# Altium project Impedance spectrometer.PrjPcb
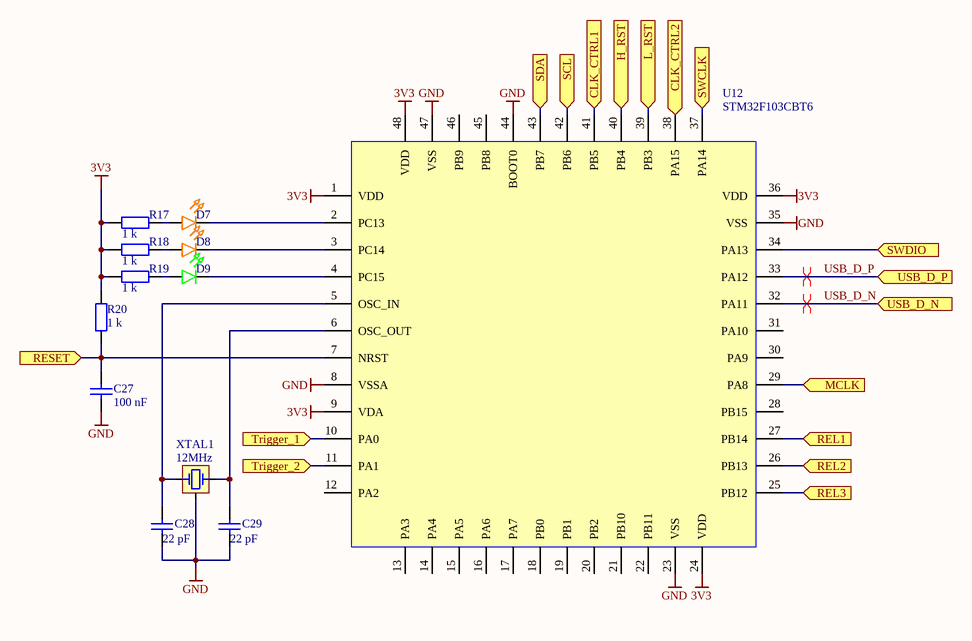
[diagram p0: Back-end.SchDoc]
4 sheets, 98 parts. Net scope: flat (ports and power ports of the same name join across sheets).
Board file: Impedance spectrometer.PcbDoc
Sheets:
  Back-end.SchDoc
  Back-end_2.SchDoc
  Front-end.SchDoc
  Power.SchDoc

## Sheet Back-end.SchDoc
size A4

### Parts
C27  100 nF  [C1206]
C28  22 pF  [C1206]
C29  22 pF  [C1206]
D7  LED Orange  [LED Diod red]  (value not drawn)
D8  LED Orange  [LED Diod red]  (value not drawn)
D9  *  [LED Diod grean]  (value not drawn)
R17  1 k  [R1206]
R18  1 k  [R1206]
R19  1 k  [R1206]
R20  1 k  [R1206]
U12  STM32F103CBT6  [LQFP48_L]
XTAL1  Value1: 12MHz  [XTAL 2.5MM X3.2MM]  (hidden comment: 7M-12.000MAAJ-T)

### Ports
CLK_CTRL1, CLK_CTRL2, H_RST, L_RST, MCLK, REL1, REL2, REL3, RESET, SCL, SDA, SWCLK, SWDIO, Trigger_1, Trigger_2, USB_D_N, USB_D_P

### Nets
3V3: R17.2 R18.2 R19.2 R20.2 U12.1(VDD) U12.9(VDA) U12.24(VDD) U12.36(VDD) U12.48(VDD)
GND: C27.1 C28.2 C29.2 U12.8(VSSA) U12.23(VSS) U12.35(VSS) U12.44(BOOT0) U12.47(VSS) XTAL1.2
USB_D_N: U12.32(PA11) ; port USB_D_N
USB_D_P: U12.33(PA12) ; port USB_D_P
NetC27_2: C27.2 R20.1 U12.7(NRST) ; port RESET
NetC28_1: C28.1 U12.5(OSC_IN) XTAL1.1(OSC1)
NetC29_1: C29.1 U12.6(OSC_OUT) XTAL1.3(OSC2)
NetD3_1: U12.29(PA8) ; port MCLK
NetD5_1: U12.43(PB7) ; port SDA
NetD5_2: U12.42(PB6) ; port SCL
NetD7_1: D7.1 R17.1
NetD7_2: D7.2 U12.2(PC13)
NetD8_1: D8.1 R18.1
NetD8_2: D8.2 U12.3(PC14)
NetD9_1: D9.1 R19.1
NetD9_2: D9.2 U12.4(PC15)
NetD10_1: U12.10(PA0) ; port Trigger_1
NetD10_2: U12.11(PA1) ; port Trigger_2
NetP3_2: U12.37(PA14) ; port SWCLK
NetP3_4: U12.34(PA13) ; port SWDIO
NetQ1_2: U12.40(PB4) ; port H_RST
NetQ2_2: U12.39(PB3) ; port L_RST
NetU10_1: U12.27(PB14) ; port REL1
NetU10_2: U12.26(PB13) ; port REL2
NetU10_3: U12.25(PB12) ; port REL3
NetU11_5: U12.38(PA15) ; port CLK_CTRL2
NetU11_6: U12.41(PB5) ; port CLK_CTRL1

Not connected (* = marked no-connect by the designer): U12 12(PA2) 13(PA3) 14(PA4) 15(PA5) 16(PA6) 17(PA7) 18(PB0) 19(PB1) 20(PB2) 21(PB10) 22(PB11) 28(PB15) 30(PA9) 31(PA10) 45(PB8) 46(PB9)

### Layout directives
differential pair: USB_D_N, USB_D_P

### Library data of the parts
C27 = Cap Semi: Capacitor (Semiconductor SIM Model); Value: 100n; Published: 8-Jun-2000; LatestRevisionDate: 29-May-2009; LatestRevisionNote: IPC-7351 Footprint Added.; PackageReference: C1206; Publisher: Altium Limited; PackageDescription: Chip Capacitor
C28 C29 = Cap Semi: Capacitor (Semiconductor SIM Model); Published: 8-Jun-2000; LatestRevisionDate: 29-May-2009; LatestRevisionNote: IPC-7351 Footprint Added.; PackageReference: C1206; Publisher: Altium Limited; PackageDescription: r0805; Value: 22 pF
D7 D8 = LED SMD Diod Orange
D9 = LED SMD Diod Green: Assembly: SMD; ComponentLink1URL: *; ComponentLink2URL: *; ComponentLink1Description: Datasheet; ComponentLink2Description: *; Tolerance1: *; Value1: *; Manufacture: *; Shop1: *; Shop1ID: *; ComponentType: Diod LED; DafaultFootprint: *; Replacement: *; Value2: *; Parameter1: *; Parameter2: *; ComponentSymbol: *; Tolerance2: *
R17-R20 = Res2: Resistor; Value: 1K; Published: 8-Jun-2000; LatestRevisionDate: 17-Jul-2002; LatestRevisionNote: Re-released for DXP Platform.; PackageReference: AXIAL-0.4; Publisher: Altium Limited; PackageDescription: Axial Device, Thru-Hole; 2 Leads; 0.4 in Pin Spacing
U12 = STM32F070CxTxx
XTAL1 = XTAL 12MHz: TXC  7M-12.000MAAJ-T  CRYSTAL, 12MHZ, 18PF, 3.2 X 2.5MM; Tolerance1: 18ppm; Value1: Farnell; Shop1ID: 2413996; DafaultFootprint: SMD XTAL 3.2mm x 2.5mm; Assembly: SMD; Parameter1: Freq; ComponentLink1URL: http://www.farnell.com/datasheets/1796637.pdf?_ga=1.82791254.1104608453.1473079731; ComponentLink2URL: *; ComponentLink1Description: Datasheet; ComponentLink2Description: *; Manufacture: TXC; ComponentType: Oscillator Quartz; Replacement: *; ComponentSymbol: 7M-12.000MAAJ-T

## Sheet Back-end_2.SchDoc
size A4
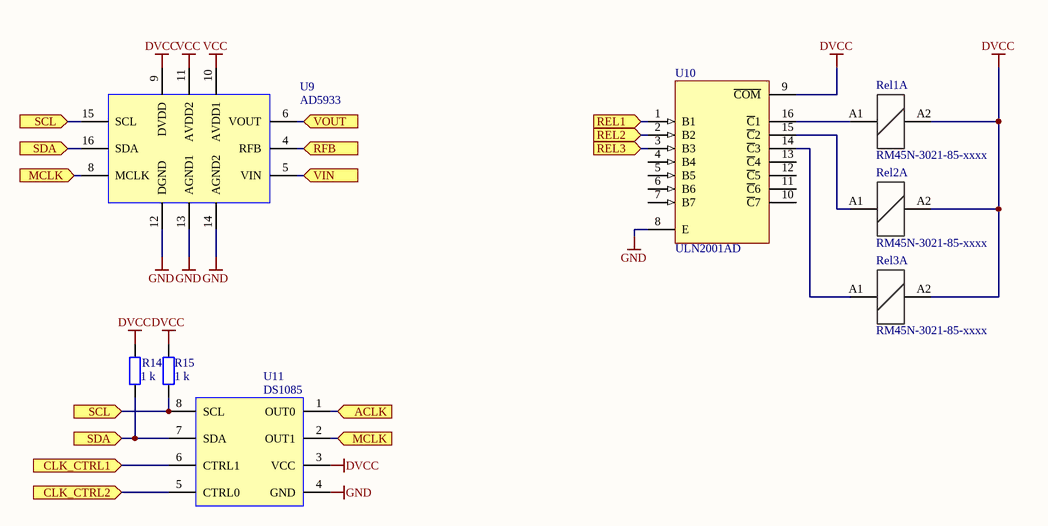
[diagram p1: Back-end_2.SchDoc]

### Parts
R14  1 k  [R1206]
R15  1 k  [R1206]
Rel1  RM45N-3021-85-xxxx  (part A of 2)
Rel2  RM45N-3021-85-xxxx  (part A of 2)
Rel3  RM45N-3021-85-xxxx  (part A of 2)
U9  AD5933
U10  ULN2001AD  [D016_N]
U11  DS1085

### Ports
ACLK, CLK_CTRL1, CLK_CTRL2, MCLK, REL1, REL2, REL3, RFB, SCL, SDA, VIN, VOUT

### Nets
DVCC: R14.2 R15.2 Rel1.A2(COIL) Rel2.A2(COIL) Rel3.A2(COIL) U9.9(DVDD) U10.9(~{COM}) U11.3(VCC)
GND: U9.12(DGND) U9.13(AGND1) U9.14(AGND2) U10.8(E) U11.4(GND)
VCC: U9.10(AVDD1) U9.11(AVDD2)
NetD3_1: U9.8(MCLK) U11.2(OUT1) ; port MCLK
NetD4_1: U11.1(OUT0) ; port ACLK
NetD5_1: R14.1 U9.16(SDA) U11.7(SDA) ; port SDA
NetD5_2: R15.1 U9.15(SCL) U11.8(SCL) ; port SCL
NetR1_1: U9.5(VIN) ; port VIN
NetR1_2: U9.4(RFB) ; port RFB
NetR11_2: U9.6(VOUT) ; port VOUT
NetRel1_A1: Rel1.A1(COIL) U10.16(~{C}1)
NetRel2_A1: Rel2.A1(COIL) U10.15(~{C}2)
NetRel3_A1: Rel3.A1(COIL) U10.14(~{C}3)
NetU10_1: U10.1(B1) ; port REL1
NetU10_2: U10.2(B2) ; port REL2
NetU10_3: U10.3(B3) ; port REL3
NetU11_5: U11.5(CTRL0) ; port CLK_CTRL2
NetU11_6: U11.6(CTRL1) ; port CLK_CTRL1

Not connected (* = marked no-connect by the designer): U10 4(B4) 5(B5) 6(B6) 7(B7) 10(~{C}7) 11(~{C}6) 12(~{C}5) 13(~{C}4)

### Library data of the parts
R14 R15 = Res2: Resistor; Value: 1K; Published: 8-Jun-2000; LatestRevisionDate: 17-Jul-2002; LatestRevisionNote: Re-released for DXP Platform.; PackageReference: AXIAL-0.4; Publisher: Altium Limited; PackageDescription: Axial Device, Thru-Hole; 2 Leads; 0.4 in Pin Spacing
U10 = ULN2001AD: Darlington Transistor Array; ComponentAvailability: Obsolete; Published: 15-May-2002; LatestRevisionDate: 13-Apr-2006; LatestRevisionNote: IPC-7351 Footprint Added.; DatasheetVersion: Sep-1986; PackageVersion: Jan-1998; PackageReference: D016; Publisher: Altium Limited; PackageDescription: 16-Pin Small Outline Integrated Circuit 1.27 mm Pitch; Code_IPC: SOIC127P600-16; ComponentLink1Description: Manufacturer Link; ComponentLink1URL: http://www.ti.com/; ComponentLink2Description: Datasheet; ComponentLink2URL: http://www-s.ti.com/sc/ds/uln2002a.pdf

## Sheet Front-end.SchDoc
size A4
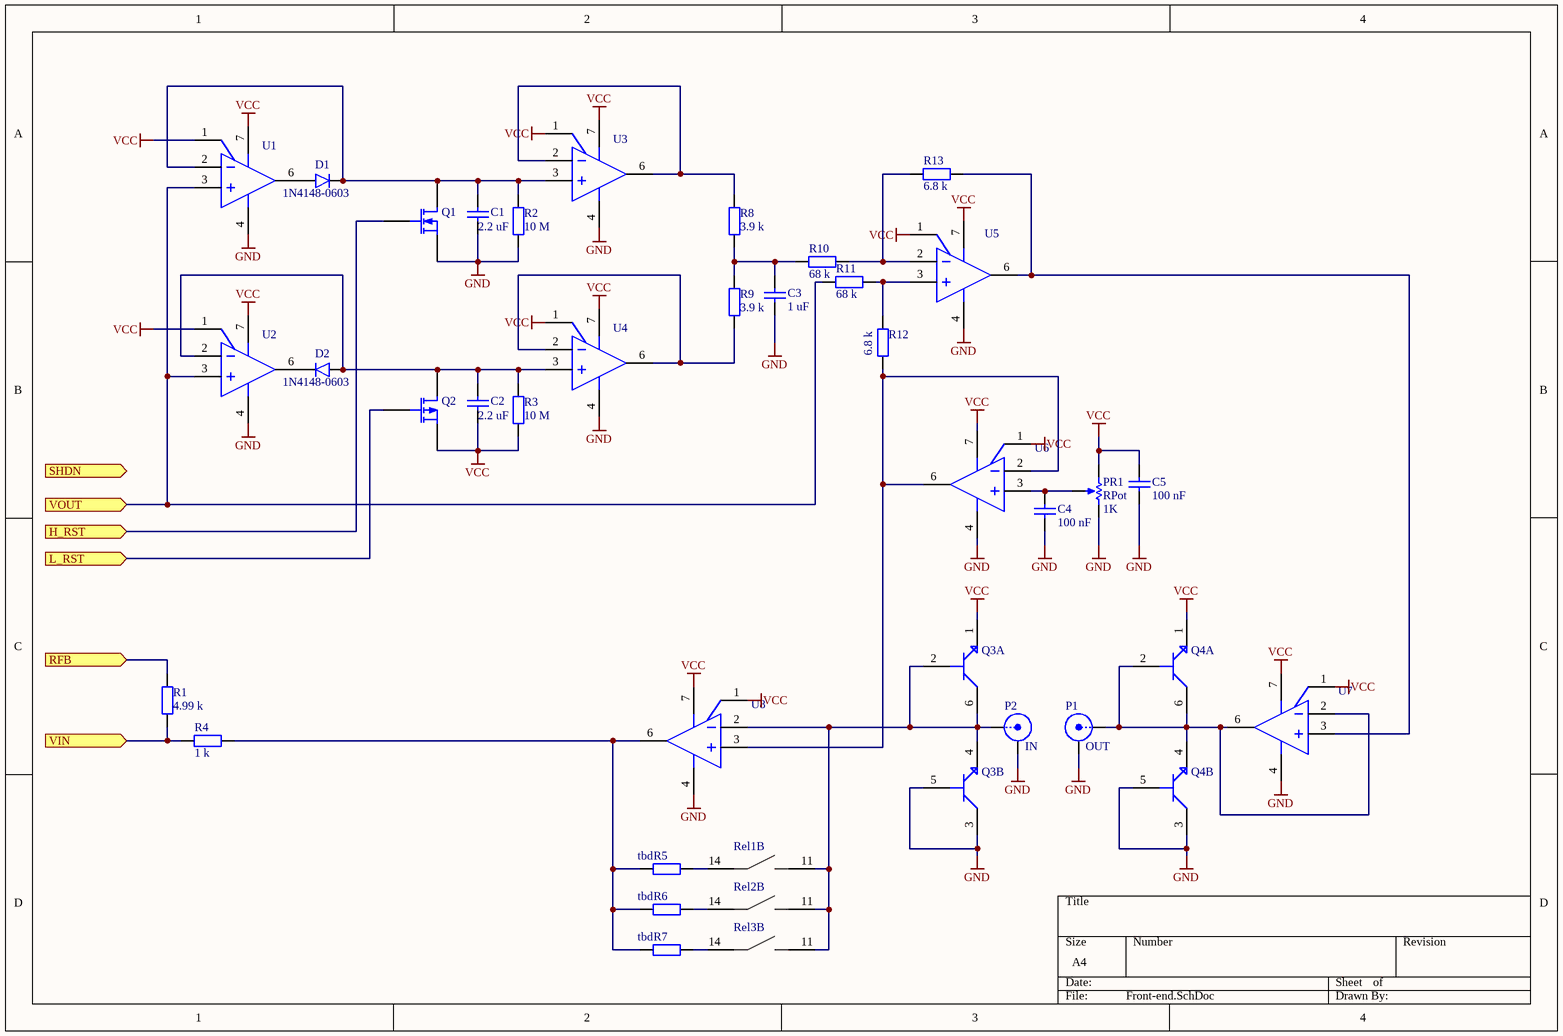
[diagram p2: Front-end.SchDoc]

### Parts
C1  2.2 uF  [C1206]
C2  2.2 uF  [C1206]
C3  1 uF  [C1206]
C4  100 nF  [C1206]
C5  100 nF  [C1206]
D1  1N4148-0603  [C1206]
D2  1N4148-0603  [C1206]
P1  OUT  [BNC_RA]
P2  IN  [BNC_RA]
PR1  RPot  value 1K  [TrimmPot]
Q1  MOSFET-N  [E3]  (value not drawn)
Q2  MOSFET-P  [E3]  (value not drawn)
Q3  MBT3904DW1T1G  (value not drawn)  (parts A,B of 2)
Q4  MBT3904DW1T1G  (value not drawn)  (parts A,B of 2)
R1  4.99 k  [R1206]
R2  10 M  [R1206]
R3  10 M  [R1206]
R4  1 k  [R1206]
R5  tbd  [R1206]
R6  tbd  [R1206]
R7  tbd  [R1206]
R8  3.9 k  [R1206]
R9  3.9 k  [R1206]
R10  68 k  [R1206]
R11  68 k  [R1206]
R12  6.8 k  [R1206]
R13  6.8 k  [R1206]
Rel1  RM45N-3021-85-xxxx  [RM45N-3021-85-xxxx]  (value not drawn)  (part B of 2)
Rel2  RM45N-3021-85-xxxx  [RM45N-3021-85-xxxx]  (value not drawn)  (part B of 2)
Rel3  RM45N-3021-85-xxxx  [RM45N-3021-85-xxxx]  (value not drawn)  (part B of 2)
U1  MAX4238  [NSO8_L]  (value not drawn)
U2  MAX4238  [NSO8_L]  (value not drawn)
U3  MAX4238  [NSO8_L]  (value not drawn)
U4  MAX4238  [NSO8_L]  (value not drawn)
U5  MAX4238  [NSO8_L]  (value not drawn)
U6  MAX4238  [NSO8_L]  (value not drawn)
U7  MAX4238  [NSO8_L]  (value not drawn)
U8  MAX4238  [NSO8_L]  (value not drawn)

### Ports
H_RST, L_RST, RFB, SHDN, VIN, VOUT

### Nets
GND: C1.1 C3.1 C4.1 C5.1 P1.2(Y) P2.2(Y) PR1.2(BOT) Q1.3(S) Q3.3 Q3.5 Q4.3 Q4.5 R2.1 U1.4 U2.4 U3.4 U4.4 U5.4 U6.4 U7.4 U8.4
VCC: C2.1 C5.2 PR1.1(TOP) Q2.3(S) Q3.1 Q4.1 R3.1 U1.1(SHDN) U1.7 U2.1(SHDN) U2.7 U3.1(SHDN) U3.7 U4.1(SHDN) U4.7 U5.1(SHDN) U5.7 U6.1(SHDN) U6.7 U7.1(SHDN) U7.7 U8.1(SHDN) U8.7
NetC1_2: C1.2 D1.1 Q1.1(D) R2.2 U1.2(-) U3.3(+)
NetC2_2: C2.2 D2.2 Q2.1(D) R3.2 U2.2(-) U4.3(+)
NetC3_2: C3.2 R8.1 R9.2 R10.2
NetC4_2: C4.2 PR1.3(TAP) U6.3(+)
NetD1_2: D1.2 U1.6
NetD2_1: D2.1 U2.6
NetP1_1: P1.1(X) Q4.2 Q4.4 Q4.6 U7.2(-) U7.6
NetP2_1: P2.1(X) Q3.2 Q3.4 Q3.6 Rel1.11(SW) Rel2.11(SW) Rel3.11(SW) U8.2(-)
NetQ1_2: Q1.2(G) ; port H_RST
NetQ2_2: Q2.2(G) ; port L_RST
NetR1_1: R1.1 R4.2 ; port VIN
NetR1_2: R1.2 ; port RFB
NetR4_1: R4.1 R5.2 R6.2 R7.2 U8.6
NetR5_1: R5.1 Rel1.14(SW)
NetR6_1: R6.1 Rel2.14(SW)
NetR7_1: R7.1 Rel3.14(SW)
NetR8_2: R8.2 U3.2(-) U3.6
NetR9_1: R9.1 U4.2(-) U4.6
NetR10_1: R10.1 R13.2 U5.2(-)
NetR11_1: R11.1 R12.1 U5.3(+)
NetR11_2: R11.2 U1.3(+) U2.3(+) ; port VOUT
NetR12_2: R12.2 U6.2(-) U6.6 U8.3(+)
NetR13_1: R13.1 U5.6 U7.3(+)

### Library data of the parts
C1 C2 = Cap Semi: Capacitor (Semiconductor SIM Model); Value: 2u2; Published: 8-Jun-2000; LatestRevisionDate: 29-May-2009; LatestRevisionNote: IPC-7351 Footprint Added.; PackageReference: C1206; Publisher: Altium Limited; PackageDescription: Chip Capacitor
C3 = Cap Semi: Capacitor (Semiconductor SIM Model); Value: 1u; Published: 8-Jun-2000; LatestRevisionDate: 29-May-2009; LatestRevisionNote: IPC-7351 Footprint Added.; PackageReference: C1206; Publisher: Altium Limited; PackageDescription: Chip Capacitor
C4 C5 = Cap Semi: as C27 on sheet Back-end; Published: 8-Jun-2000; LatestRevisionDate: 29-May-2009; LatestRevisionNote: IPC-7351 Footprint Added.; PackageReference: C1206; Publisher: Altium Limited; PackageDescription: Chip Capacitor
D1 D2 = 1N4148: Dioda: przełączająca; SMD; 100V; 150mA; 4ns; 0603; Manufacture: DC COMPONENTS; Shop1: TME; DafaultFootprint: 0603; Value1: 75V; Parameter1: Vr; Parameter2: If; ComponentLink1URL: http://www.tme.eu/pl/Document/56f18f971963fb7c3e40973a6fd3d82c/CD4148W_WT.pdf; ComponentLink2URL: *; ComponentLink1Description: Datasheet; ComponentLink2Description: *; Tolerance1: *; Shop1ID: *; ComponentType: Diod Rectifier; Assembly: SMD; Replacement: *; ComponentSymbol: 1N4148-0603; Value2: 150mA
P1 P2 = BNC: BNC Elbow Connector; LatestRevisionDate: 17-Jul-2002; LatestRevisionNote: Re-released for DXP Platform.; Publisher: Altium Limited
PR1 = RPot: Potentiometer; Sim Note: Enter the Resistance value and the set point into parameter fields.; Set Position: 0.5; Published: 8-Jun-2000; LatestRevisionDate: 17-Jul-2002; LatestRevisionNote: Re-released for DXP Platform.; PackageReference: VR5; Publisher: Altium Limited; PackageDescription: Variable Resistor, Thru-Hole; 3 Leads
Q1 = MOSFET-N: N-Channel MOSFET; Published: 8-Jun-2000; LatestRevisionDate: 17-Jul-2002; LatestRevisionNote: Re-released for DXP Platform.; PackageVersion: 1995/1996; PackageReference: E3; Publisher: Altium Limited; PackageDescription: TO, Flat Index; 3 In-Line, Axial Leads; Body Dia. 4.6mm; Lead Dia. 0.5 mm (max)
Q2 = MOSFET-P: P-Channel MOSFET; Published: 8-Jun-2000; LatestRevisionDate: 17-Jul-2002; LatestRevisionNote: Re-released for DXP Platform.; PackageVersion: 1995/1996; PackageReference: E3; Publisher: Altium Limited; PackageDescription: TO, Flat Index; 3 In-Line, Axial Leads; Body Dia. 4.6mm; Lead Dia. 0.5 mm (max)
R1 = Res2: Resistor; Value: 4k99; Published: 8-Jun-2000; LatestRevisionDate: 17-Jul-2002; LatestRevisionNote: Re-released for DXP Platform.; PackageReference: AXIAL-0.4; Publisher: Altium Limited; PackageDescription: Axial Device, Thru-Hole; 2 Leads; 0.4 in Pin Spacing
R2 R3 = Res2: Resistor; Value: 10M; Published: 8-Jun-2000; LatestRevisionDate: 17-Jul-2002; LatestRevisionNote: Re-released for DXP Platform.; PackageReference: AXIAL-0.4; Publisher: Altium Limited; PackageDescription: Axial Device, Thru-Hole; 2 Leads; 0.4 in Pin Spacing
R4 = Res2: Resistor; Value: 1k; Published: 8-Jun-2000; LatestRevisionDate: 17-Jul-2002; LatestRevisionNote: Re-released for DXP Platform.; PackageReference: AXIAL-0.4; Publisher: Altium Limited; PackageDescription: Axial Device, Thru-Hole; 2 Leads; 0.4 in Pin Spacing
R5-R7 = Res2: Resistor; Value: 1K; Published: 8-Jun-2000; LatestRevisionDate: 17-Jul-2002; LatestRevisionNote: Re-released for DXP Platform.; PackageReference: AXIAL-0.4; Publisher: Altium Limited; PackageDescription: Axial Device, Thru-Hole; 2 Leads; 0.4 in Pin Spacing
R8 R9 = Res2: Resistor; Value: 3k9; Published: 8-Jun-2000; LatestRevisionDate: 17-Jul-2002; LatestRevisionNote: Re-released for DXP Platform.; PackageReference: AXIAL-0.4; Publisher: Altium Limited; PackageDescription: Axial Device, Thru-Hole; 2 Leads; 0.4 in Pin Spacing
R10 R11 = Res2: Resistor; Value: 68k; Published: 8-Jun-2000; LatestRevisionDate: 17-Jul-2002; LatestRevisionNote: Re-released for DXP Platform.; PackageReference: AXIAL-0.4; Publisher: Altium Limited; PackageDescription: Axial Device, Thru-Hole; 2 Leads; 0.4 in Pin Spacing
R12 R13 = Res2: Resistor; Value: 6k8; Published: 8-Jun-2000; LatestRevisionDate: 17-Jul-2002; LatestRevisionNote: Re-released for DXP Platform.; PackageReference: AXIAL-0.4; Publisher: Altium Limited; PackageDescription: Axial Device, Thru-Hole; 2 Leads; 0.4 in Pin Spacing
U1-U8 = MAX4298/4299

## Sheet Power.SchDoc
size A4
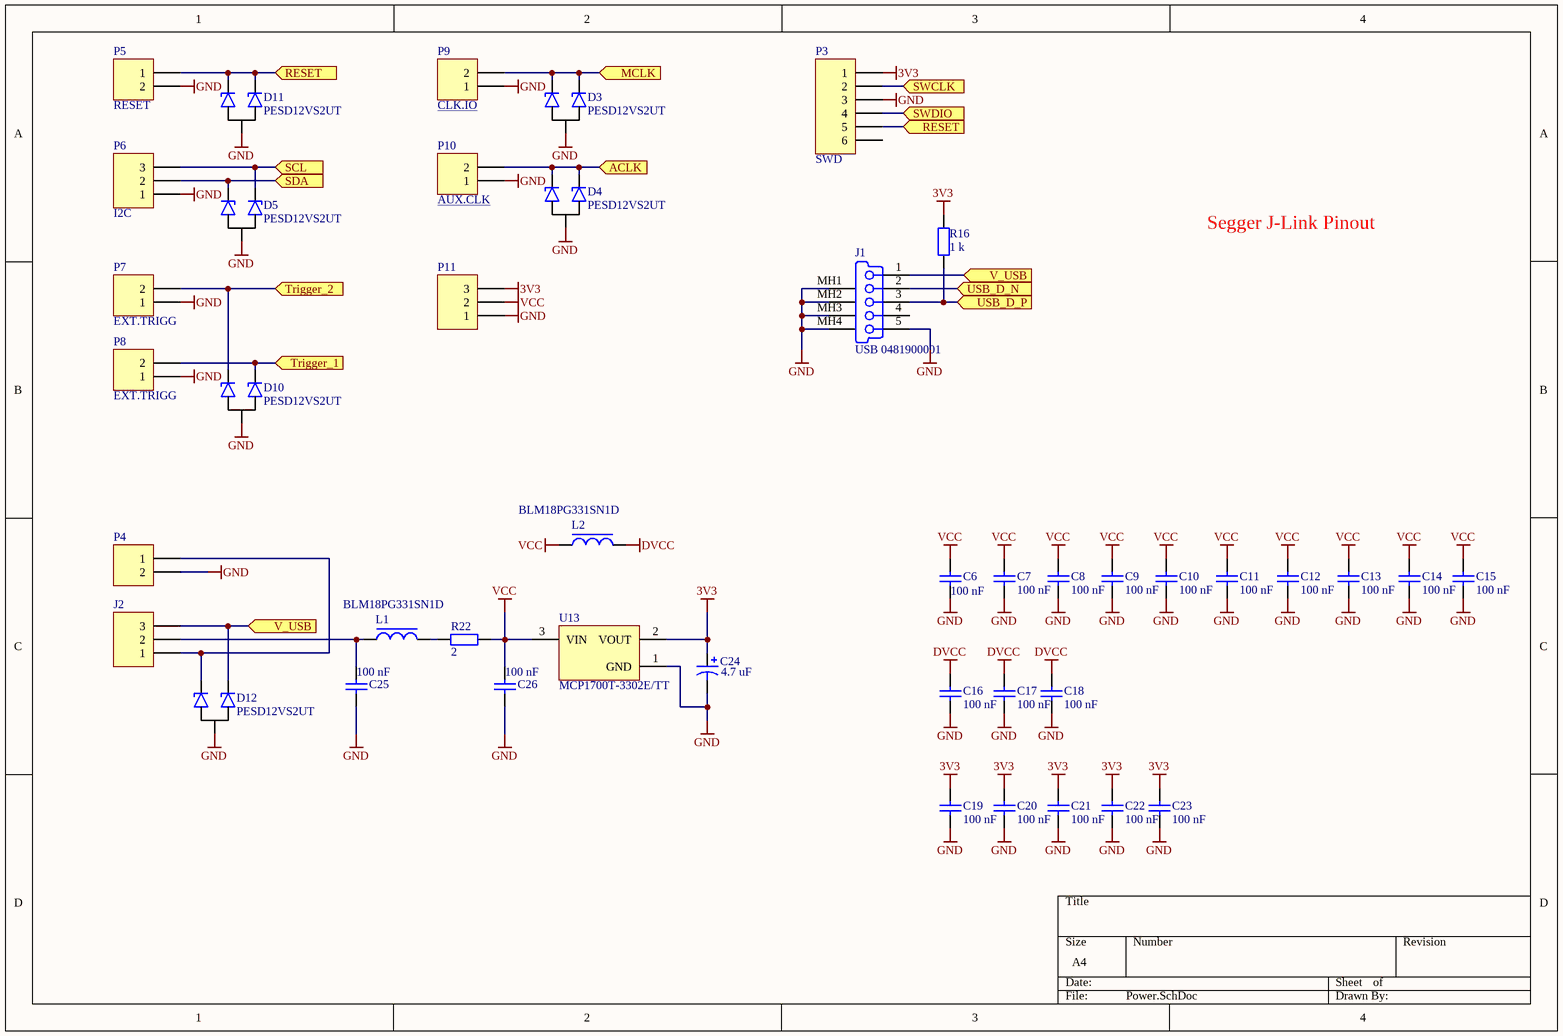
[diagram p3: Power.SchDoc]

### Parts
C6  100 nF  [C1206]
C7  100 nF  [C1206]
C8  100 nF  [C1206]
C9  100 nF  [C1206]
C10  100 nF  [C1206]
C11  100 nF  [C1206]
C12  100 nF  [C1206]
C13  100 nF  [C1206]
C14  100 nF  [C1206]
C15  100 nF  [C1206]
C16  100 nF  [C1206]
C17  100 nF  [C1206]
C18  100 nF  [C1206]
C19  100 nF  [C1206]
C20  100 nF  [C1206]
C21  100 nF  [C1206]
C22  100 nF  [C1206]
C23  100 nF  [C1206]
C24  4.7 uF  [C1206]
C25  100 nF  [C1206]
C26  100 nF  [C1206]
D3  PESD12VS2UT  [SOT-23]
D4  PESD12VS2UT  [SOT-23]
D5  PESD12VS2UT  [SOT-23]
D10  PESD12VS2UT  [SOT-23]
D11  PESD12VS2UT  [SOT-23]
D12  PESD12VS2UT  [SOT-23]
J1  USB 0481900001  [Mini USB-B]
J2  Header 3  [Pin Header 1x3 TH Pitch 2.54mm]  (value not drawn)
L1  BLM18PG331SN1D  [R1206]
L2  BLM18PG331SN1D  [R1206]
P3  SWD  [Pin Header 1x6 TH Pitch 2.54mm]
P4  Header 2  [Pin Header 1x2 TH Pitch 2.54mm]  (value not drawn)
P5  RESET  [Pin Header 1x2 TH Pitch 2.54mm]
P6  I2C  [Pin Header 1x3 TH Pitch 2.54mm]
P7  EXT.TRIGG  [Pin Header 1x2 TH Pitch 2.54mm]
P8  EXT.TRIGG  [Pin Header 1x2 TH Pitch 2.54mm]
P9  CLK.IO  [Pin Header 1x2 TH Pitch 2.54mm]
P10  AUX.CLK  [Pin Header 1x2 TH Pitch 2.54mm]
P11  Header 3  [Pin Header 1x3 TH Pitch 2.54mm]  (value not drawn)
R16  1 k  [R1206]
R22  2  [R1206]
U13  MCP1700T-3302E/TT  [SOT-23_L]

### Ports
ACLK, MCLK, RESET, SCL, SDA, SWCLK, SWDIO, Trigger_1, Trigger_2, USB_D_N, USB_D_P, V_USB

### Nets
3V3: C19.2 C20.2 C21.2 C22.2 C23.2 C24.1 P3.1 P11.3 R16.2 U13.2(VOUT)
DVCC: C16.2 C17.2 C18.2 L2.2
GND: C6.1 C7.1 C8.1 C9.1 C10.1 C11.1 C12.1 C13.1 C14.1 C15.1 C16.1 C17.1 C18.1 C19.1 C20.1 C21.1 C22.1 C23.1 C24.2 C25.2 C26.2 D3.3 D4.3 D5.3 D10.3 D11.3 D12.3 J1.5(GND) J1.MH1(Tab) J1.MH2(Tab) J1.MH3(Tab) J1.MH4(Tab) P3.3 P4.2 P5.2 P6.1 P7.1 P8.1 P9.1 P10.1 P11.1 U13.1(GND)
VCC: C6.2 C7.2 C8.2 C9.2 C10.2 C11.2 C12.2 C13.2 C14.2 C15.2 C26.1 L2.1 P11.2 R22.1 U13.3(VIN)
USB_D_N: J1.2(D-) ; port USB_D_N
USB_D_P: J1.3(D+) R16.1 ; port USB_D_P
NetC25_1: C25.1 J2.2 L1.1
NetC27_2: D11.1 D11.2 P3.5 P5.1 ; port RESET
NetD3_1: D3.1 D3.2 P9.2 ; port MCLK
NetD4_1: D4.1 D4.2 P10.2 ; port ACLK
NetD5_1: D5.1 P6.2 ; port SDA
NetD5_2: D5.2 P6.3 ; port SCL
NetD10_1: D10.1 P8.2 ; port Trigger_1
NetD10_2: D10.2 P7.2 ; port Trigger_2
NetD12_1: D12.1 J1.1(V_BUS_(5V)) J2.3 ; port V_USB
NetD12_2: D12.2 J2.1 P4.1
NetL1_2: L1.2 R22.2
NetP3_2: P3.2 ; port SWCLK
NetP3_4: P3.4 ; port SWDIO

Not connected (* = marked no-connect by the designer): J1 4(NC); P3 6

### Notes on the sheet
- Segger J-Link Pinout

### Library data of the parts
C6-C23 C25 C26 = Cap Semi: Capacitor (Semiconductor SIM Model); Published: 8-Jun-2000; LatestRevisionDate: 29-May-2009; LatestRevisionNote: IPC-7351 Footprint Added.; PackageReference: C1206; Publisher: Altium Limited; PackageDescription: Chip Capacitor; Value: 100 nF
C24 = Cap Pol3: Polarized Capacitor (Surface Mount); Published: 8-Jun-2000; LatestRevisionDate: 29-May-2009; LatestRevisionNote: IPC-7351 Footprint Added.; PackageReference: C0805; Publisher: Altium Limited; PackageDescription: Chip Capacitor; Value: 4.7 uF
D3-D5 D10-D12 = PESD5V2S2UT: Transil diod
J1 = USB 0481900001: USB On-The-Go (OTG) Mini-B Receptacle, Right Angle, SMT, 0.80mm (.031") Pitch, Solder Tabs with Back Cover, Recessed Type; Manufacture: MOLEX; Assembly: SMD; ComponentSymbol: 48190-0001; ComponentLink1Description: Manufacturer Link; ComponentLink1URL: http://www.molex.com/; ComponentLink2Description: Datasheet; ComponentLink2URL: http://www.molex.com/cmc_upload/0/000/895/958/SD-48190-001RevA.pdf; ComponentType: Connector USB
J2 P6 P11 = Header 3: Header, 3-Pin; LatestRevisionDate: 17-Jul-2002; LatestRevisionNote: Re-released for DXP Platform.; Publisher: Altium Limited
L1 L2 = BLM18PG331SN1D: Ferrit Bead; Manufacture: MURATA; Tolerance1: ± %; Value1: 150mΩ; DafaultFootprint: 0603; Assembly: SMD; Replacement: Rated Current; Value2: 330Ω; Parameter1: DC resistance; Parameter2: Impedance (at 100MHz/20°C); Value3: 1.2A; ComponentLink1URL: http://www.farnell.com/datasheets/5148.pdf?_ga=1.67637201.1104608453.1473079731; ComponentLink2URL: *; ComponentLink1Description: Datasheet; ComponentLink2Description: *; Shop1: *; Shop1ID: *; ComponentType: Ferrite Bead; ComponentSymbol: BLM18PG331SN1D; Tolerance2: ± %; DielectrikType: *
P3 = Header 6: Header, 6-Pin; LatestRevisionDate: 17-Jul-2002; LatestRevisionNote: Re-released for DXP Platform.; Publisher: Altium Limited
P4 P5 P7-P10 = Header 2: Header, 2-Pin; LatestRevisionDate: 17-Jul-2002; LatestRevisionNote: Re-released for DXP Platform.; Publisher: Altium Limited
R16 = Res2: Resistor; Value: 1K; Published: 8-Jun-2000; LatestRevisionDate: 17-Jul-2002; LatestRevisionNote: Re-released for DXP Platform.; PackageReference: AXIAL-0.4; Publisher: Altium Limited; PackageDescription: Axial Device, Thru-Hole; 2 Leads; 0.4 in Pin Spacing
R22 = Res2: Resistor; Value: 10; Published: 8-Jun-2000; LatestRevisionDate: 17-Jul-2002; LatestRevisionNote: Re-released for DXP Platform.; PackageReference: AXIAL-0.4; Publisher: Altium Limited; PackageDescription: Axial Device, Thru-Hole; 2 Leads; 0.4 in Pin Spacing
U13 = MCP1700T-3302E/TT: Low Quiescent Current LDO, 3-Pin SOT-23, Extended Temperature, Tape and Reel; Published: 29-Jan-2009; DatasheetVersion: revB, Feb-2007; PackageVersion: revBB, Aug-2009; PackageReference: SOT-23-TT3; Publisher: Altium Limited; PackageDescription: 3-Lead Plastic Small Outline Transistor (TT) [SOT-23]; Supplier 1: Digi-Key; Supplier Part Number 1: MCP1700T3302ETTTR-ND; Supplier 2: Digi-Key; Supplier Part Number 2: MCP1700T3302ETTCT-ND; Supplier 3: Digi-Key; Supplier Part Number 3: MCP1700T3302ETTDKR-ND; Supplier 4: Farnell; Supplier Part Number 4: 1296592; Code_IPC: SOT23-3; ComponentLink1Description: Datasheet; ComponentLink1URL: http://ww1.microchip.com/downloads/en/DeviceDoc/21826b.pdf; ComponentLink2Description: Packaging Specification; ComponentLink2URL: http://www.microchip.com/stellent/groups/techpub_sg/documents/packagingspec/en012702.pdf; ComponentLink3Description: Microchip.com Home; ComponentLink3URL: http://www.microchip.com/

## Nets that join several sheets
3V3: Back-end (9 pins), Power (10 pins)
DVCC: Back-end_2 (8 pins), Power (C16.2 C17.2 C18.2 L2.2)
GND: Back-end (9 pins), Back-end_2 (5 pins), Front-end (21 pins), Power (42 pins)
VCC: Back-end_2 (U9.10 U9.11), Front-end (23 pins), Power (15 pins)
NetC27_2: Back-end (C27.2 R20.1 U12.7), Power (D11.1 D11.2 P3.5 P5.1)
NetD3_1: Back-end (U12.29), Back-end_2 (U9.8 U11.2), Power (D3.1 D3.2 P9.2)
NetD4_1: Back-end_2 (U11.1), Power (D4.1 D4.2 P10.2)
NetD5_1: Back-end (U12.43), Back-end_2 (R14.1 U9.16 U11.7), Power (D5.1 P6.2)
NetD5_2: Back-end (U12.42), Back-end_2 (R15.1 U9.15 U11.8), Power (D5.2 P6.3)
NetD10_1: Back-end (U12.10), Power (D10.1 P8.2)
NetD10_2: Back-end (U12.11), Power (D10.2 P7.2)
NetP3_2: Back-end (U12.37), Power (P3.2)
NetP3_4: Back-end (U12.34), Power (P3.4)
NetQ1_2: Back-end (U12.40), Front-end (Q1.2)
NetQ2_2: Back-end (U12.39), Front-end (Q2.2)
NetR1_1: Back-end_2 (U9.5), Front-end (R1.1 R4.2)
NetR1_2: Back-end_2 (U9.4), Front-end (R1.2)
NetR11_2: Back-end_2 (U9.6), Front-end (R11.2 U1.3 U2.3)
NetU10_1: Back-end (U12.27), Back-end_2 (U10.1)
NetU10_2: Back-end (U12.26), Back-end_2 (U10.2)
NetU10_3: Back-end (U12.25), Back-end_2 (U10.3)
NetU11_5: Back-end (U12.38), Back-end_2 (U11.5)
NetU11_6: Back-end (U12.41), Back-end_2 (U11.6)
USB_D_N: Back-end (U12.32), Power (J1.2)
USB_D_P: Back-end (U12.33), Power (J1.3 R16.1)